# EAGLE design Board (EAGLE 9.6.2)
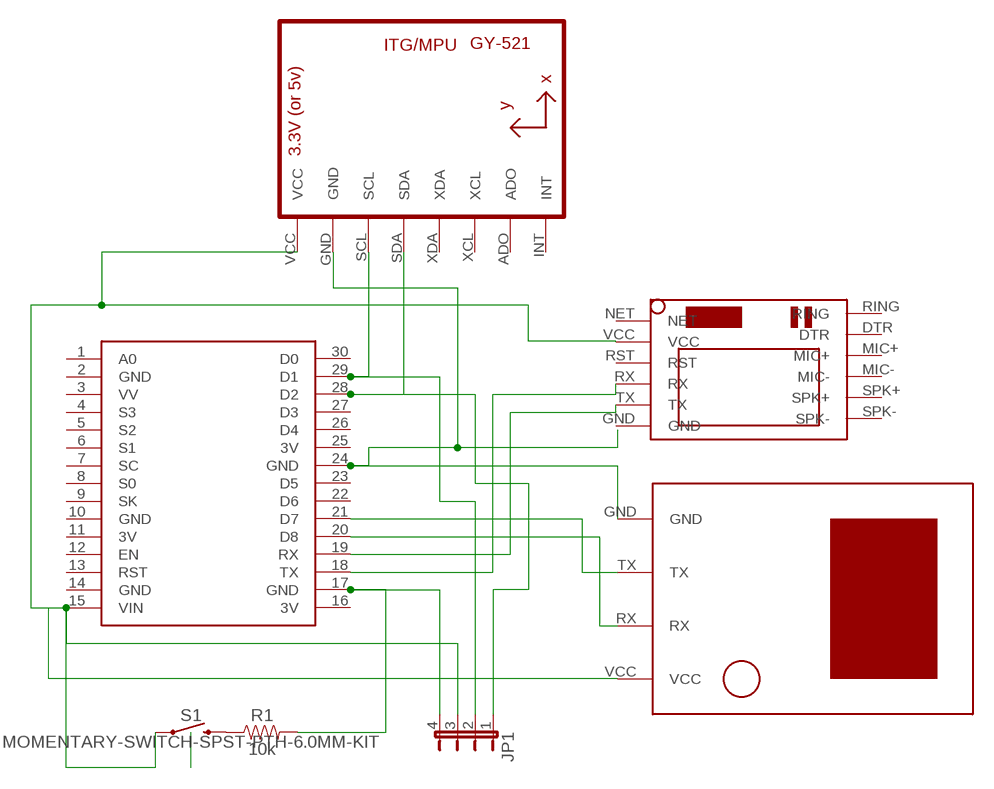
[diagram p0: schematic, sheet 1]

## Parts
JP1  JP4E  [JP4]
R1  10k  10KOHM-HORIZ-1/4W-1%  [AXIAL-0.3]
S1  MOMENTARY-SWITCH-SPST-PTH-6.0MM-KIT  [TACTILE_SWITCH_PTH_6.0MM_KIT]
U1  GY-521MPU6050  [GY-521]
U$1  NODEMCU  [NODEMCU]
U$2  SIM800LMODULE  [SIM800LMODULE]
U$3  U-BLOX-NEO6V2  [U-BLOX-NEO6V2]

## Nets
N$1: U$1.21(D7) U$3.TX
N$2: U$1.20(D8) U$3.RX
N$3: U$1.19(RX) U$2.TX
N$4: U$1.18(TX) U$2.RX
N$5: U1.GND U$1.24(GND) U$3.GND
N$6: JP1.3 S1.1 U1.VCC U$1.15(VIN) U$2.VCC U$3.VCC
N$7: JP1.2 U1.SCL U$1.29(D1)
N$8: JP1.1 U1.SDA U$1.28(D2)
N$10: R1.P$1 S1.3
N$11: JP1.4 R1.P$2 U$1.17(GND)
Unconnected: U1.ADO U1.INT U1.XCL U1.XDA U$1.1(A0) U$1.3(VV) U$1.4(S3) U$1.5(S2) U$1.6(S1) U$1.7(SC) U$1.8(S0) U$1.9(SK) U$1.12(EN) U$1.13(RST) U$1.22(D6) U$1.23(D5) U$1.26(D4) U$1.27(D3) U$1.30(D0) U$2.DTR U$2.GND U$2.MIC+ U$2.MIC- U$2.NET U$2.RING U$2.RST U$2.SPK+ U$2.SPK-

## Power pins joined to a net without a drawn wire
3V: U$1.11(3V) U$1.16(3V) U$1.25(3V)
GND: U$1.2(GND) U$1.10(GND) U$1.14(GND)

## Library data of the parts
JP1 = jumper:JP4E: JUMPER
R1 = SparkFun-Resistors:10KOHM: 10kΩ resistor A resistor is a passive two-terminal electrical component that implements electrical resistance as a circuit element. Resistors act to reduce current flow, and, at the same time, act to lower voltage levels within circuits. - Wikipedia; PROD_ID: RES-12183
S1 = SparkFun-Switches:MOMENTARY-SWITCH-SPST: Momentary Switch (Pushbutton) - SPST Normally-open (NO) SPST momentary switches (buttons, pushbuttons). Variants PTH-12MM - 12mm square, through-hole Momentary Pushbutton Switch - 12mm Square <https://www.sparkfun.com/products/9190> (COM-09190) PTH-6.0MM, PTH-6.0MM-KIT - 6.0mm square, through-hole Mini Pushbutton Switch <https://www.sparkfun.com/products/97> (COM-00097) KIT package intended for soldering kit's - only one side of pads' copper is exposed. PTH-RIGHT-ANGLE-KIT - Right-angle, through-hole Right Angle Tactile Button <https://www.sparkfun.com/products/10791> - Used on SparkFun BigTime Watch Kit <https://www.sparkfun.com/products/11734> SMD-12MM - 12mm square, surface-mount Tactile Button - SMD (12mm) <https://www.sparkfun.com/products/12993> (COM-12993) Used on SparkFun PicoBoard <https://www.sparkfun.com/products/11888> SMD-4.5MM - 4.5mm Square Trackball Switch Used on SparkFun Blackberry Trackballer Breakout <https://www.sparkfun.com/products/13169> SMD-4.6MMX2.8MM - 4.60mm x 2.80mm, surface mount Used on SparkFun SAMD21 Mini Breakout <https://www.sparkfun.com/products/13664> SMD-5.2MM, SMD-5.2-REDUNDANT - 5.2mm square, surface-mount Mini Pushbutton Switch - SMD <https://www.sparkfun.com/products/8720> (COM-08720) Used on Arduino Pro Mini <https://www.sparkfun.com/products/11114> REDUNDANT package connects both switch circuits together SMD-6.0X3.5MM - 6.0 x 3.5mm, surface mount Momentary Reset Switch SMD <https://www.sparkfun.com/products/8229> (COM-08229) SMD-6.2MM-TALL - 6.2mm square, surface mount Tactile Button - SMD (6mm) <https://www.sparkfun.com/products/12992> Used on SparkFun Digital Sandbox <https://www.sparkfun.com/products/12651> SMD-RIGHT-ANGLE - Right-angle, surface mount Used on SparkFun Block for Intel® Edison - Arduino <https://www.sparkfun.com/products/13036>; PROD_ID: SWCH-08441; SF_SKU: COM-00097
U1 = gy-521:GY-521
U$1 = nodemcu:NODEMCU
U$2 = SIM800LMODULE:SIM800LMODULE: SIM800L Module
U$3 = u-blox neo-6m v2:U-BLOX-NEO6V2

## Board
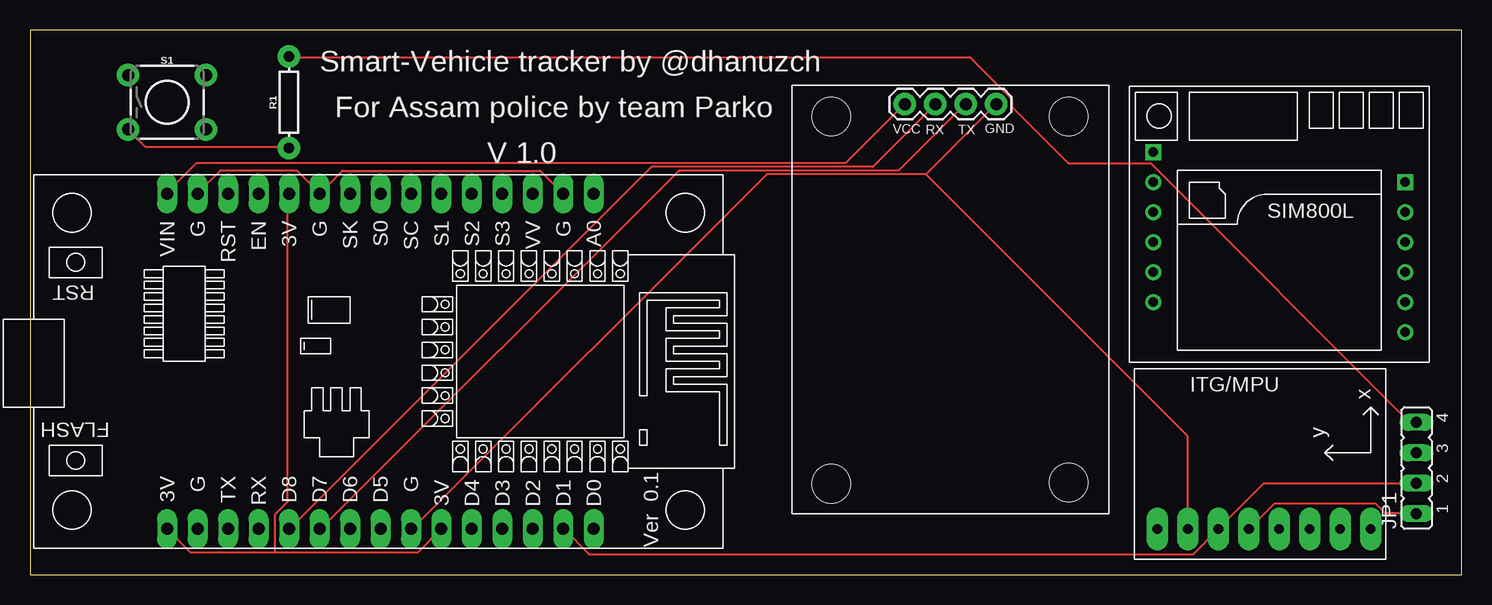
[diagram p1: board, top side]
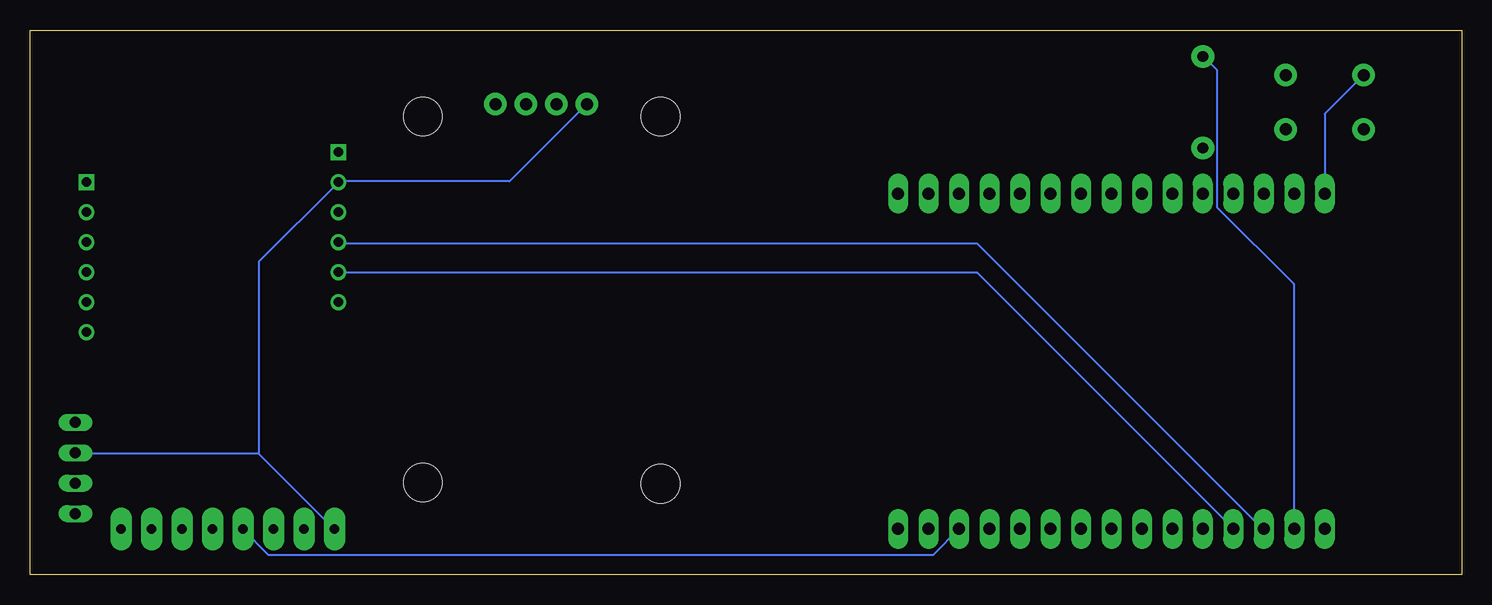
[diagram p2: board, bottom side, seen from below]

Size 119.36 x 45.39 mm. Coordinates in mm from the lower left corner, seen from the top.
Outline: 0,0 119.36,0 119.36,45.39 0,45.39 0,0
Copper layers (1*16): Top 0.035mm / dielectric 1.5mm / Bottom 0.035mm
Design rules "default": minimum track width 6mil, minimum drill 0.35mm, track to track 6mil, track to pad 6mil, pad to pad 6mil, via to via 6mil, smd to smd 6mil, copper to edge 40mil, drill to drill 6mil, minimum pad ring 10mil, minimum via ring 8mil, stop-mask expansion 4mil, vias tented up to drill 0mil, thermal gap 10mil

### Footprints (pad centres in the part's own frame; a part is rotated, then mirrored left to right if it is on the bottom)
JP4 = drill 0.914 long: 1 -3.81,0; 2 -1.27,0; 3 1.27,0; 4 3.81,0
AXIAL-0.3 = drill 0.9 pad 1.88: P$1 -3.81,0; P$2 3.81,0
TACTILE_SWITCH_PTH_6.0MM_KIT = drill 1.016 pad 1.88: 1 -3.251,2.261; 2 3.251,2.261; 3 -3.251,-2.261; 4 3.251,-2.261
GY-521 = drill 0.8 pad 1.778 long: ADO -8.89,-6.35; GND -8.89,6.35; INT -8.89,-8.89; SCL -8.89,3.81; SDA -8.89,1.27; VCC -8.89,8.89; XCL -8.89,-3.81; XDA -8.89,-1.27
NODEMCU = drill 1 pad 1.676 long: 1 -13.97,17.78; 2 -13.97,15.24; 3 -13.97,12.7; 4 -13.97,10.16; 5 -13.97,7.62; 6 -13.97,5.08; 7 -13.97,2.54; 8 -13.97,0; 9 -13.97,-2.54; 10 -13.97,-5.08; 11 -13.97,-7.62; 12 -13.97,-10.16; 13 -13.97,-12.7; 14 -13.97,-15.24; 15 -13.97,-17.78; 16 13.97,-17.78; 17 13.97,-15.24; 18 13.97,-12.7; 19 13.97,-10.16; 20 13.97,-7.62; 21 13.97,-5.08; 22 13.97,-2.54; 23 13.97,0; 24 13.97,2.54; 25 13.97,5.08; 26 13.97,7.62; 27 13.97,10.16; 28 13.97,12.7; 29 13.97,15.24; 30 13.97,17.78
SIM800LMODULE = drill 0.8: DTR 10.5,1; GND -10.5,-6.5; MIC+ 10.5,-1.5; MIC- 10.5,-4; RST -10.5,1; RX -10.5,-1.5; SPK+ 10.5,-6.5; SPK- 10.5,-9; TX -10.5,-4; VCC -10.5,3.5 | drill 0.8 square: NET -10.5,6; RING 10.5,3.5
U-BLOX-NEO6V2 = drill 1.016 pad 1.88: GND 17.05,34.13; RX 11.97,34.13; TX 14.51,34.13; VCC 9.43,34.13 | hole 3.2: 3.3,33.1; 23.1,33.1; 3.3,2.5; 23.1,2.6

### Placement (x,y rotation side)
JP1  115.57,8.89 90 top
R1  21.59,39.37 90 top
S1  11.43,39.37 0 top
U1  102.87,12.7 90 top
U$1  29.21,17.78 270 top
U$2  104.14,29.21 0 top
U$3  63.5,5.08 0 top

### Tracks (layer width: path | path; a pad name or v marks a point on that pad's centre or on a via)
3V
  Top 0.152: U$1.16 13.41,1.83 20.42,1.83 | 20.42,1.83 32.31,1.83 U$1.25 | 20.42,1.83 20.42,5.03 21.49,6.1 21.49,31.7 U$1.11
GND
  Top 0.152: U$1.14 14.02,31.85 15.85,33.68 22.25,33.68 24.08,31.85 U$1.10 26.06,33.68 42.52,33.68 U$1.2
N$1
  Top 0.152: U$1.21 24.23,3.81 54.1,33.68 72.39,33.68 77.88,39.17 U$3.TX
N$2
  Top 0.152: U$1.20 21.64,3.81 51.82,33.98 70.26,33.98 75.44,39.17 U$3.RX
N$3
  Bottom 0.152: U$1.19 40.39,25.15 93.57,25.15 U$2.TX
N$4
  Bottom 0.152: U$2.RX 93.57,27.58 40.39,27.58 16.61,3.81 U$1.18
N$5
  Top 0.152: 74.68,33.38 61.42,33.38 31.85,3.81 U$1.24 | 74.68,33.38 80.47,39.17 U$3.GND | 74.68,33.38 96.47,11.58 96.47,3.81 U1.GND
N$6
  Top 0.152: U$1.15 11.43,31.85 13.87,34.29 67.97,34.29 72.85,39.17 U$3.VCC
  Bottom 0.152: 100.28,10.06 115.52,10.06 JP1.3 | 100.28,10.06 94.03,3.81 U1.VCC | U$1.15 11.43,38.41 8.23,41.6 S1.1 | U$3.VCC 73,39.17 79.4,32.77 93.57,32.77 U$2.VCC 93.73,32.61 100.28,26.06 100.28,10.06
N$7
  Top 0.152: JP1.2 102.87,7.62 U1.SCL 96.93,1.68 46.63,1.68 44.5,3.81 U$1.29
N$8
  Top 0.152: JP1.1 115.52,5.18 112.93,5.18 112.17,5.94 103.78,5.94 101.65,3.81 U1.SDA
  Bottom 0.152: U$1.28 44.04,1.68 99.52,1.68 101.65,3.81 U1.SDA
N$10
  Top 0.152: R1.P$1 21.49,35.66 9.6,35.66 8.23,37.03 S1.3
N$11
  Top 0.152: JP1.4 115.52,12.8 114.91,12.8 93.42,34.29 86.56,34.29 81.84,39.01 81.84,39.62 78.33,43.13 21.64,43.13 R1.P$2
  Bottom 0.152: U$1.17 14.02,3.81 14.02,24.23 20.42,30.63 20.42,42.06 21.49,43.13 R1.P$2

### Text on the board
tSilk: Smart-Vehicle tracker by @dhanuzch | For Assam police by team Parko | V 1.0